# EAGLE design on glass pcb v0 (EAGLE 9.7.0)
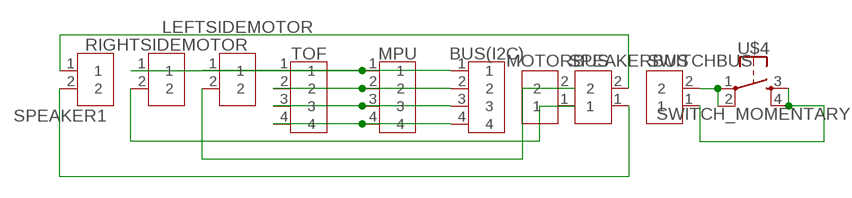
[diagram p0: schematic, sheet 1]

## Parts
BUS(I2C)  JST-XH-4PIN  B4B-XH-A  [B4B-XH-A]
LEFTSIDEMOTOR  JST-VH-2PIN  B2P-VH  [B2P-VH_396-2N]
MOTORBUS  JST-VH-2PIN  B2P-VH  [B2P-VH_396-2N]
MPU  JST-XH-4PIN  B4B-XH-A  [B4B-XH-A]
RIGHTSIDEMOTOR  JST-VH-2PIN  B2P-VH  [B2P-VH_396-2N]
SPEAKER1  JST-VH-2PIN  B2P-VH  [B2P-VH_396-2N]
SPEAKERBUS  JST-VH-2PIN  B2P-VH  [B2P-VH_396-2N]
SWITCHBUS  JST-VH-2PIN  B2P-VH  [B2P-VH_396-2N]
TOF  JST-XH-4PIN  B4B-XH-A  [B4B-XH-A]
U$4  SWITCH_MOMENTARY  [SWITCH-MOMENTARY-PTH-6.5MM]

## Nets
N$1: BUS(I2C).1 LEFTSIDEMOTOR.1 MPU.1 RIGHTSIDEMOTOR.1 TOF.1
N$2: MOTORBUS.1 RIGHTSIDEMOTOR.2
N$3: BUS(I2C).3 MPU.3 TOF.3
N$4: BUS(I2C).4 MPU.4 TOF.4
N$5: SPEAKER1.2 SPEAKERBUS.1
N$6: SPEAKER1.1 SPEAKERBUS.2
N$7: SWITCHBUS.2 U$4.1 U$4.2
N$8: SWITCHBUS.1 U$4.3 U$4.4
N$9: LEFTSIDEMOTOR.2 MOTORBUS.2
N$11: BUS(I2C).2 MPU.2 TOF.2

## Library data of the parts
BUS(I2C) MPU TOF = Connector:B4B-XH-A: XH Connector Top Entry - 4POS Details see: Datasheet <http://www.jst-mfg.com/product/pdf/eng/eXH.pdf>; CATEGORY: Header; DSECRIPTION: Connector Header Through Hole 4 position 0.098" (2.50mm); MANUFACTURER: JST Sales America Inc.; MPN: B4B-XH-A(LF)(SN); OPERATING_TEMPERATURE: -25 C to 85 C; PART_STATUS: ACTIVE; PITCH: 0.098" (2.50mm); ROHS_COMPLIANCE: ROHS3 Compliant; SERIES: XH; SUB_CATEGORY: Rectangular Connectors; TYPE: Header, Male Pin, Board to Cable/Wire, Through Hole
LEFTSIDEMOTOR MOTORBUS RIGHTSIDEMOTOR SPEAKER1 SPEAKERBUS SWITCHBUS = Connector:B2P-VH: VH Connector Top Entry - 2POS, 3.96MM Details see: Datasheet <http://www.jst-mfg.com/product/pdf/eng/eVH.pdf>; CATEGORY: Header; DESCRIPTION: Connector Header Through Hole 2 position 0.156" (3.96mm); MANUFACTURER: JST Sales America Inc.; MPN: B2P-VH; OPERATING_TEMPERATURE: -25°C ~ 85°C; PART_STATUS: Active; PITCH: 0.156" (3.96mm); ROHS_COMPLIANCE: RoHS non-compliant; SERIES: VH; SUBCATEGORY: Rectangular Connectors; TYPE: Header, Male Pin, Board to Cable/Wire, Through Hole
U$4 = Tinkercad:SWITCH_MOMENTARY

## Board
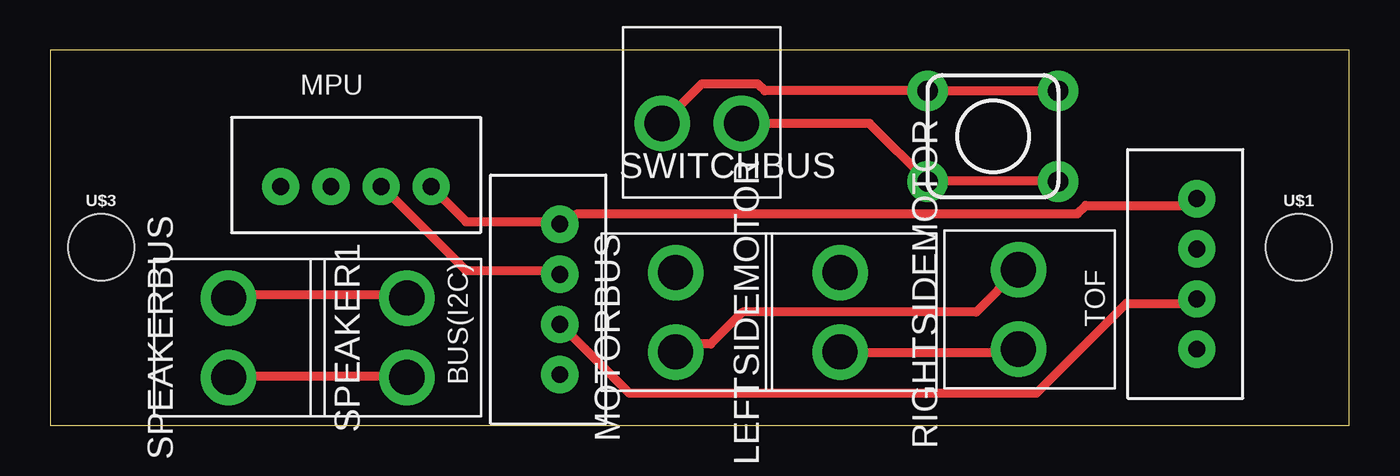
[diagram p1: board, top side]
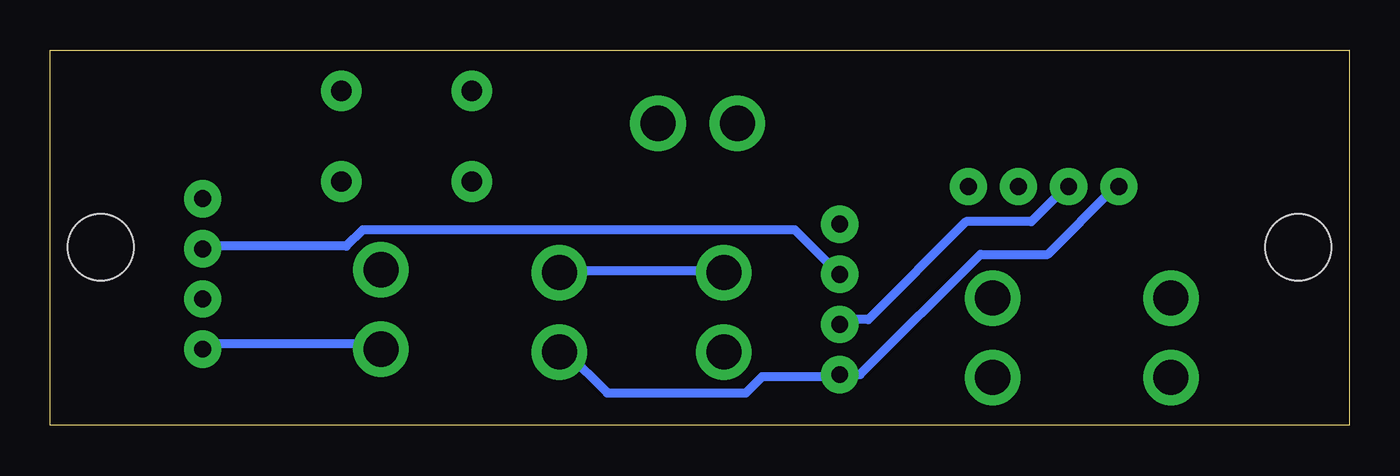
[diagram p2: board, bottom side, seen from below]

Size 64.75 x 18.72 mm. Coordinates in mm from the lower left corner, seen from the top.
Outline: 0,0 64.75,0 64.75,18.72 0,18.72 0,0
Copper layers (1*16): Top / Bottom
Stack-up Default Layer Stack: Top SilkScreen Epoxy Ink / Top SolderMask SR:Green 0.0254mm Dk 4.3 / Top Surface Finish Lead-Free 0.02mm / Top CuFoil:007 0.035mm / Dielectric-1 User Defined 1.5mm / Bottom CuFoil:007 0.035mm / Bottom Surface Finish Lead-Free 0.02mm / Bottom SolderMask SR:Green 0.0254mm Dk 4.3 / Bottom SilkScreen Epoxy Ink
Design rules: minimum drill size 20mil, minimum copper width 18mil, keepout clearance 0mil, drill distance 20mil, via restrict clearance 0mil, dimension clearance 40mil, restrict clearance 0mil, copper clearance wire_polygon to wire_polygon 14mil, copper clearance wire_polygon to pad_smd 14mil, copper clearance wire_polygon to via 14mil, copper clearance pad_smd to pad_smd 14mil, copper clearance pad_smd to via 14mil, copper clearance via to via 14mil, copper clearance smd to pad (same net) 14mil, copper clearance smd to via (same net) 14mil, copper clearance smd to smd (same net) 14mil

### Footprints (pad centres in the part's own frame; a part is rotated, then mirrored left to right if it is on the bottom)
B4B-XH-A = drill 0.84: 1 0,0; 2 2.5,0; 3 5,0; 4 7.5,0
B2P-VH_396-2N = drill 1.75: 1 0,0; 2 3.96,0
STAND-OFF = hole 3.302: 0,0
SWITCH-MOMENTARY-PTH-6.5MM = drill 1.016 pad 1.88: 1 -3.251,2.261; 2 3.251,2.261; 3 -3.251,-2.261; 4 3.251,-2.261

### Placement (x,y rotation side)
BUS(I2C)  25.4,2.54 90 top
LEFTSIDEMOTOR  39.37,3.67 90 top
MOTORBUS  31.17,3.67 90 top
MPU  11.49,11.92 0 top
RIGHTSIDEMOTOR  48.26,3.81 90 top
SPEAKER1  17.78,6.36 270 top
SPEAKERBUS  8.89,2.4 90 top
SWITCHBUS  34.46,15.07 180 top
TOF  57.15,3.81 90 top
U$1  [STAND-OFF]  62.23,8.89 0 top
U$3  [STAND-OFF]  2.54,8.89 0 top
U$4  46.99,14.43 0 top

### Tracks (layer width: path | path; a pad name or v marks a point on that pad's centre or on a via)
N$1
  Top 0.457: RIGHTSIDEMOTOR.1 47.95,3.66 39.42,3.66 LEFTSIDEMOTOR.1
  Bottom 0.457: TOF.1 56.9,4.06 48.36,4.06 RIGHTSIDEMOTOR.1 | LEFTSIDEMOTOR.1 39.01,3.66 36.98,1.63 30.07,1.63 29.26,2.44 25.6,2.44 BUS(I2C).1 24.38,2.54 18.39,8.53 15.04,8.53 11.79,11.79 MPU.1
N$2
  Top 0.457: MOTORBUS.1 31.29,4.06 32.92,4.06 34.52,5.66 46.15,5.66 RIGHTSIDEMOTOR.2
N$3
  Top 0.457: BUS(I2C).3 25.2,7.72 20.73,7.72 16.66,11.79 MPU.3
  Bottom 0.457: TOF.3 56.9,8.94 49.99,8.94 49.17,9.75 27.64,9.75 25.6,7.72 BUS(I2C).3
N$4
  Top 0.457: MPU.4 19.1,11.79 20.73,10.16 25.2,10.16 BUS(I2C).4 26.29,10.57 51.21,10.57 51.61,10.97 56.9,10.97 TOF.4
N$5
  Top 0.457: SPEAKERBUS.1 8.94,2.44 17.48,2.44 SPEAKER1.2
N$6
  Top 0.457: SPEAKERBUS.2 8.94,6.5 17.48,6.5 SPEAKER1.1
N$7
  Top 0.457: U$4.2 49.99,16.66 43.89,16.66 U$4.1 35.62,16.69 35.27,17.03 32.46,17.03 SWITCHBUS.2
N$8
  Top 0.457: U$4.4 49.99,12.19 43.89,12.19 U$4.3 40.84,15.07 SWITCHBUS.1
N$9
  Bottom 0.457: MOTORBUS.2 31.29,7.72 39.01,7.72 LEFTSIDEMOTOR.2
N$11
  Top 0.457: TOF.2 56.9,6.1 53.65,6.1 49.17,1.63 28.85,1.63 25.6,4.88 BUS(I2C).2
  Bottom 0.457: BUS(I2C).2 25.2,5.28 23.98,5.28 19.1,10.16 15.85,10.16 14.22,11.79 MPU.2